# EasyEDA Pro project ROS_Car_F4VG_2024-01-24.eprj

# Schematic Schematic1
Create Date: 2024-01-24; Page Name: P1; Project Name: ROS_Car_F4VG_2024-01-24; Schematic Name: Schematic1; Update Date: 2024-03-10; Company: 嘉立创EDA; Page Size: A4; Version: V1.0
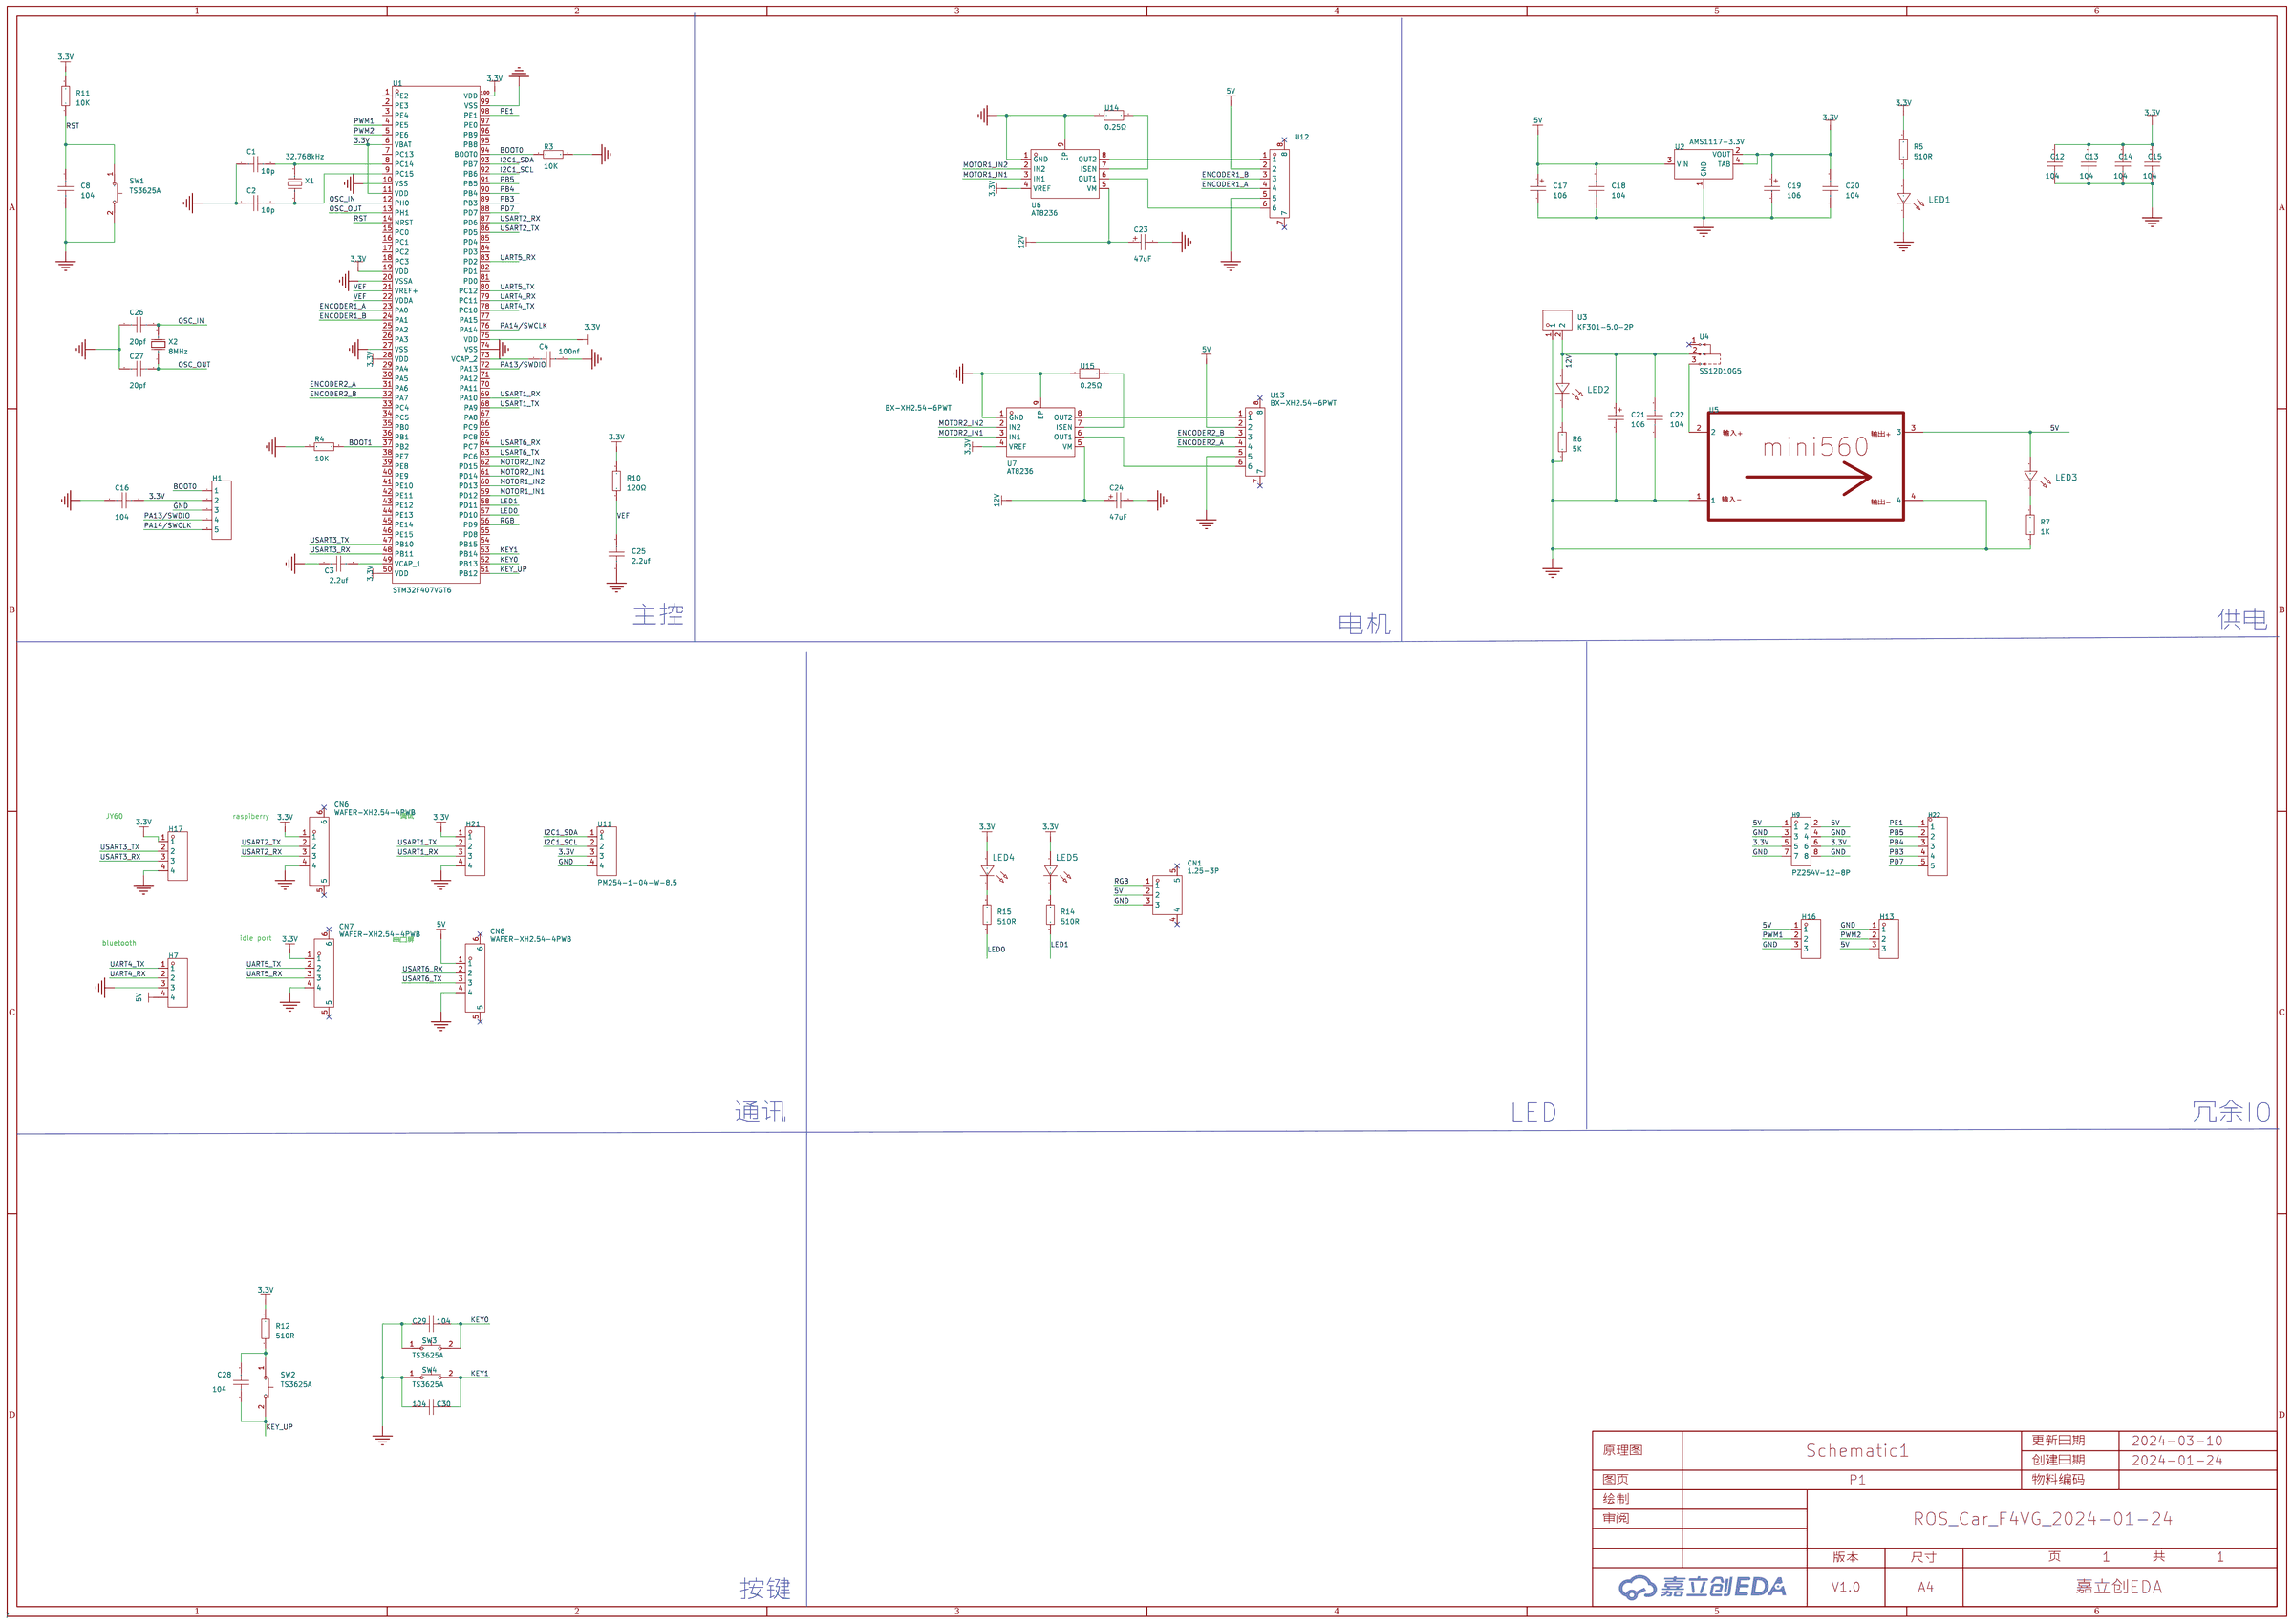
[diagram p0: schematic sheet]

## Parts
C1  10p  [C0603]
C2  10p  [C0603]
C3  2.2uf  [C0603]
C4  100nf  [C0603]
C8  104  [C0603]
C12  104  [C0603]
C13  104  [C0603]
C14  104  [C0603]
C15  104  [C0603]
C16  104  [C0603]
C17  106  [C_Ele_SMD_4x5.5mm]
C18  104  [C0603]
C19  106  [C_Ele_SMD_4x5.5mm]
C20  104  [C0603]
C21  106  [C_Ele_SMD_4x5.5mm]
C22  104  [C0603]
C23  47uF  [C_Ele_SMD_5x5.4mm]
C24  47uF  [C_Ele_SMD_5x5.4mm]
C25  2.2uf  [C0603]
C26  20pf  [C0603]
C27  20pf  [C0603]
C28  104  [C0603]
C29  104  [C0603]
C30  104  [C0603]
CN1  1.25-3P  [CONN-SMD_1.25-3P]
CN6  WAFER-XH2.54-4PWB  [CONN-TH_4P-P0.20_XUNPU_WAFER-XH2.54-4PWB]
CN7  WAFER-XH2.54-4PWB  [CONN-TH_4P-P0.20_XUNPU_WAFER-XH2.54-4PWB]
CN8  WAFER-XH2.54-4PWB  [CONN-TH_4P-P0.20_XUNPU_WAFER-XH2.54-4PWB]
H1  -  [HDR-TH_5P-P2.54-V-F]
H7  -  [HDR-TH_4P-P2.54-V-F]
H9  PZ254V-12-8P  [HDR-TH_8P-P2.54-V-M-R2-C4-S2.54]
H13  -  [HDR-TH_3P-P2.54-V-F]
H16  -  [HDR-TH_3P-P2.54-V-M]
H17  -  [HDR-TH_4P-P2.54-V-F]
H21  -  [HDR-TH_4P-P2.54-V-M]
H22  -  [HDR-TH_5P-P2.54-V-M]
LED1  -  [LED_0603]
LED2  -  [LED_0603]
LED3  -  [LED_0603]
LED4  -  [LED_0603]
LED5  -  [LED_0603]
R3  10K  [R0603]
R4  10K  [R0603]
R5  510R  [R0603]
R6  5K  [R0603]
R7  1K  [R0603]
R10  120Ω  [R0603]
R11  10K  [R0603]
R12  510R  [R0603]
R14  510R  [R0603]
R15  510R  [R0603]
SW1  TS3625A  [KEY-SMD_L6.0-W3.5-LS8.4]
SW2  TS3625A  [KEY-SMD_L6.0-W3.5-LS8.4]
SW3  TS3625A  [KEY-SMD_L6.0-W3.5-LS8.4]
SW4  TS3625A  [KEY-SMD_L6.0-W3.5-LS8.4]
U1  STM32F407VGT6  [LQFP-100_L14.0-W14.0-P0.50-LS16.0-BL]
U2  AMS1117-3.3V  [SOT_223]
U3  KF301-5.0-2P  [CONN-TH_P5.00_KF301-5.0-2P]
U4  SS12D10G5  [SW-TH_SHOU-HAN_SS12D10G4]
U5  -  [min560邮票孔]
U6  AT8236  [ESOP-8_L4.9-W3.9-P1.27-LS6.0-BL-EP]
U7  AT8236  [ESOP-8_L4.9-W3.9-P1.27-LS6.0-BL-EP]
U11  PM254-1-04-W-8.5  [HDR-TH_4P-P2.54-H-F-W10.0-N]
U12  BX-XH2.54-6PWT  [CONN-SMD_6P-P2.50_BX-XH2.54-6PWT]
U13  BX-XH2.54-6PWT  [CONN-SMD_6P-P2.50_BX-XH2.54-6PWT]
U14  0.25Ω  [R2512]
U15  0.25Ω  [R2512]
X1  32.768kHz  [OSC-SMD_L3.2-W1.5]
X2  8MHz  [CRYSTAL-SMD_L5.0-W3.2]

## Library data of the parts
C1-C4 C8 C12-C16 C18 C20 C22 C25-C30 = CAP_0603: Supplier Footprint: 0603
C17 C19 C21 = C_Ele_SMD_4x5.5mm: Supplier Footprint: SMD,4x5.5mm
C23 C24 = C_Ele_SMD_5x5.4mm: Supplier Footprint: SMD,5x5.4mm
CN1 = 1.25-3P: 插针结构:1x3P;间距:1.25mm;安装方式:-;行距:-;总PIN数:3P;排数:1;每排PIN数:3;参考系列:-;触头材质:-;; LCSC Part Name: 1x3P 间距:1.25mm 耐温; Supplier Part: C393944; Manufacturer: SHOU HAN(首韩); Supplier Footprint: SMD,P=1.25mm; JLCPCB Part Class: Extended Part; Datasheet: https://atta.szlcsc.com/upload/public/pdf/source/20190521/C393944_5848BB82F8C78E5E1FBACDDA5B503C47.pdf; Supplier: LCSC; Pins Structure: 1x3P; Pitch: 1.25mm; Number of Pins: 3P; Number of Rows: 1; Number of PINs Per Row: 3
CN6-CN8 = WAFER-XH2.54-4PWB: 插针结构:1x4P;间距:2.5mm;安装方式:卧贴;总PIN数:4P;排数:1;每排PIN数:4;额定电流:3A;工作温度范围:-25℃~+85℃;; LCSC Part Name: 1x4P 间距:2.5mm 卧贴; Supplier Part: C3029478; Manufacturer: XUNPU(讯普); Supplier Footprint: SMD,P=2.5mm; JLCPCB Part Class: 扩展库; Datasheet: https://atta.szlcsc.com/upload/public/pdf/source/20220527/7ACD2214A426F03D9ACD52F5A71E518C.pdf; Supplier: LCSC; Pins Structure: 1x4P; Pitch: 2.5mm; Mounting Style: 卧贴; Number of Pins: 4P; Number of Rows: 1; Number of PINs Per Row: 4; Current Rating (Max): 3A; Operating Temperature Range: -25℃~+85℃
H1 = HDR-F_2.54_1x5P: Supplier Part: C50950; Supplier Footprint: 插件
H7 H17 = HDR-F_2.54_1x4P: Supplier Part: C2718488; Supplier Footprint: 插件
H9 = PZ254V-12-8P: 排数:双排;总PIN位数:8P;间距:2.54mm;插针结构:2x4P;行距:2.54mm;安装类型:直插;圆针/方针:方针;额定电流:-;额定电压:-;配合针长度:6mm;塑高:2.5mm;端接针长度:3mm;触头材质:黄铜;触头镀层:-;工作温度范围:-40℃~+105℃;颜色:黑色;; LCSC Part Name: 2.54mm 2x4P 直插 方针; Supplier Part: C492421; Manufacturer: XFCN(兴飞); Supplier Footprint: 插件,P=2.54mm; JLCPCB Part Class: 扩展库; Datasheet: https://atta.szlcsc.com/upload/public/pdf/source/20200309/C492421_DC8A206AF99CD7755BD4A5B0BC48200B.pdf; Supplier: LCSC; Number of Rows: 双排; Number of Pins: 8P; Pitch: 2.54mm; Pin Structure: 2x4P; Row Spacing: 2.54mm; Mounting Type: 直插; Circluar Pins/Square Pins: 方针; Length of Mating Pin: 6mm; Insulation Height: 2.5mm; Length of End Connection Pin: 3mm; Contact Material: 黄铜; Operating Temperature Range: -40℃~+105℃; Color: 黑色
H13 = HDR-F_2.54_1x3P: Supplier Part: C541850; Supplier Footprint: 插件
H16 = HDR-M_2.54_1x3P: Supplier Part: C2937625; Supplier Footprint: 插件
H21 = HDR-M_2.54_1x4P: Supplier Part: C492403; Supplier Footprint: 插件
H22 = HDR-M_2.54_1x5P: Supplier Part: C358687; Supplier Footprint: 插件
LED1-LED5 = LED_0603-R: Supplier Footprint: 0603
R3-R7 R10-R12 R14 R15 = Res_0603: Supplier Footprint: 0603
SW1-SW4 = TS3625A: 电路结构:单刀单掷;按钮形状:矩形按钮;开关长度:6.1mm;开关宽度:3.65mm;开关高度:2.5mm;触点电流:50mA;额定电压(DC):12V;安装方式:立贴;带灯:-;作用力:250gf;机械寿命:-;; LCSC Part Name: 6.1*3.65*2.5mm 立贴 轻触开关; Supplier Part: C398053; Manufacturer: SHOU HAN(首韩); Supplier Footprint: SMD; JLCPCB Part Class: 扩展库; Datasheet: https://atta.szlcsc.com/upload/public/pdf/source/20190620/C398053_EFFFB524A3F966B1F45EE8333D1EDECC.pdf; Supplier: LCSC; Circuit: 单刀单掷; Actuator Style: 矩形按钮; Switch Length: 6.1mm; Switch Width: 3.65mm; Switch Height: 2.5mm; Contact Current: 50mA; Voltage Rating (DC): 12V; Mounting Style: 立贴; Operating Force: 250gf
U1 = STM32F407VGT6: CPU内核:ARM Cortex-M4;CPU最大主频:168MHz;工作电压范围:1.8V~3.6V;程序存储容量:1MB;程序存储器类型:FLASH;RAM总容量:192KB;GPIO端口数量:82;; Supplier Part: C12345; Manufacturer: ST(意法半导体); Supplier Footprint: LQFP-100(14x14); JLCPCB Part Class: 扩展库; Datasheet: https://atta.szlcsc.com/upload/public/pdf/source/20140801/1457707197138.pdf; Supplier: LCSC; CPU Core: ARM Cortex-M4; CPU Maximum Speed: 168MHz; Operating Voltage Range: 1.8V~3.6V; Program Storage Size: 1MB; Program Memory Type: FLASH; RAM Size: 192KB; GPIO Ports Number: 82; ADC (Bit): 12bit; DAC (Bit): 12bit; Universal Serial Bus: 有; Peripheral/Function: DMA；LCD/LED驱动; Watchdog: 有; Infrared Data Association: 有; Low-Voltage Detect: 有; LCD Module: 有; Direct Memory Access: 有; Internal Oscillator: 有; Operating Temperature Range: -40℃~+85℃
U2 = AMS1117
U3 = KF301-5.0-2P: 间距:5mm;结构:1x2P;排数:1;每排PIN数:2;安装方式:直插;额定电流:17A;额定电压:250V;线规 - AWG:14~22;线规 - mm2:1.5;工作温度范围:-30℃~+120℃;颜色:蓝色;; LCSC Part Name: 5mm 1x2P 排数:1 每排P数:2 直插 可拼接 铜 环保; Supplier Part: C474881; Manufacturer: KEFA(科发); Supplier Footprint: 插件,P=5mm; JLCPCB Part Class: 扩展库; Datasheet: https://atta.szlcsc.com/upload/public/pdf/source/20230317/03A5B5FC229D6F9225E8F51DA1A4E80A.pdf; Supplier: LCSC; Pitch: 5mm; Structure: 1x2P; Number of Rows: 1; Number of PINs Per Row: 2; Mounting Style: 直插; Current Rating (Max): 17A; Voltage Rating (Max): 250V; Wire Gauge - AWG: 14~22; Wire Gauge - mm2: 1.5; Operating Temperature Range: -30℃~+120℃; Color: 蓝色; Number of Pins: 2P
U4 = SS12D10G5: LCSC Part Name: 两档立式插件 3脚拨动开关 柄长5.0mm; Supplier Part: C7431054; Manufacturer: SHOU HAN(首韩); Supplier Footprint: 插件; JLCPCB Part Class: 扩展库; Datasheet: https://atta.szlcsc.com/upload/public/pdf/source/20231130/7A3DB6A149BF0A1DCFFE64FFC07FE434.pdf; Supplier: LCSC
U5 = mini560邮票孔
U6 U7 = AT8236: Supplier Part: C2827823; Manufacturer: 杭州中科微; Supplier Footprint: ESOP-8; JLCPCB Part Class: 扩展库; Datasheet: https://atta.szlcsc.com/upload/public/pdf/source/20210923/1552D95CBAF8BE780D06AE79E7783380.pdf; Supplier: LCSC
U11 = PM254-1-04-W-8.5: 插孔结构:1x4P;间距:2.54mm;行距:-;圆孔/方孔:方孔;安装类型:弯插;排数:单排;总孔位数:4P;额定电流:3A;额定电压:-;插孔方向:侧面;塑高:8.5mm;工作温度范围:-40℃~+105℃;; LCSC Part Name: 间距:2.54mm 1x4P 弯插; Supplier Part: C2897386; Manufacturer: HCTL(华灿天禄); Supplier Footprint: 弯插,P=2.54mm; JLCPCB Part Class: 扩展库; Datasheet: https://atta.szlcsc.com/upload/public/pdf/source/20230609/7BA40A3D721268A082DCDEAD4C99131B.pdf; Supplier: LCSC; Holes Structure: 1x4P; Pitch: 2.54mm; Circular Hole / Square Hole: 方孔; Mounting Type: 弯插; Number of Rows: 单排; Number of Holes: 4P; Current Rating (Max): 3A; Holes Direction: 侧面; Insulation Height: 8.5mm; Operating Temperature Range: -40℃~+105℃
U12 U13 = BX-XH2.54-6PWT: 插针结构:1x6P;间距:2.54mm;安装方式:卧贴;参考系列:XH;总PIN数:6P;排数:1;每排PIN数:6;行距:-;额定电流:3A;触头材质:黄铜;触头镀层:锡;工作温度范围:-25℃~+85℃;; Supplier Part: C18077876; Manufacturer: Bossie(博锡); Supplier Footprint: SMD,P=2.54mm,卧贴; Datasheet: https://atta.szlcsc.com/upload/public/pdf/source/20231017/64D9F5F4DF3195A55081C7A3CFAC85FD.pdf; Supplier: LCSC; Pins Structure: 1x6P; Pitch: 2.54mm; Mounting Style: 卧贴; Reference Series: XH; Number of Pins: 6P; Number of Rows: 1; Number of PINs Per Row: 6; Current Rating (Max): 3A; Contact Material: 黄铜; Contact Plating: 锡; Operating Temperature Range: -25℃~+85℃
U14 U15 = SCR2512F1R: 阻值:1Ω;精度:±1%;; LCSC Part Name: 1Ω ±1%; Supplier Part: C3017419; Manufacturer: VO(翔胜); Supplier Footprint: 2512; JLCPCB Part Class: Extended Part; Datasheet: https://atta.szlcsc.com/upload/public/pdf/source/20220513/247AF9639BA21CF93567DC289CCC6A22.pdf; Supplier: LCSC; Tolerance: ±1%
X1 = X321532768KGD2SI: 晶振类型:贴片晶振;频率:32.768kHz;常温频差:±20ppm;外接负载电容:12.5pF;; LCSC Part Name: 32.768kHz ±20ppm 12.5pF; Supplier Part: C620155; Manufacturer: YXC(扬兴晶振); Supplier Footprint: SMD3215-2P; JLCPCB Part Class: 扩展库; Datasheet: https://atta.szlcsc.com/upload/public/pdf/source/20210329/C620155_E5A74FC0D27C5E9015A8D75DE9484FEA.pdf; Supplier: LCSC; Crystal Type: 贴片晶振; Normal temperature Frequency Tolerance: ±20ppm; External load capacitor: 12.5pF; Operating Temperature: -40℃~+85℃
X2 = X50328MSB2GI: 晶振类型:贴片晶振;频率:8MHz;常温频差:±10ppm;外接负载电容:20pF;频率稳定度(全温):±50ppm;; LCSC Part Name: 8MHz ±10ppm 20pF YSX530GA; Supplier Part: C115962; Manufacturer: YXC(扬兴晶振); Supplier Footprint: SMD5032-2P; JLCPCB Part Class: 基础库; Datasheet: https://atta.szlcsc.com/upload/public/pdf/source/20230220/0EBFFB9D6D8CE6A211407822BBB6C516.pdf; Supplier: LCSC; Crystal Type: 贴片晶振; Normal temperature Frequency Tolerance: ±10ppm; External load capacitor: 20pF; Frequency Stability(Full temperature range): ±50ppm; Operating Temperature: -40℃~+85℃

## Nets
3.3V: C12.2 C13.2 C14.2 C15.2 C16.2 C19.1 C20.2 CN6.1 CN7.1 H1.2 H9.5 H9.6 H17.1 H21.1 LED4.2(A) LED5.2(A) R5.2 R10.2 R11.2 R12.1 U1.6(VBAT) U1.11(VDD) U1.19(VDD) U1.28(VDD) U1.50(VDD) U1.75(VDD) U1.100(VDD) U2.2(VOUT) U2.4(TAB) U6.4(VREF) U7.4(VREF) U11.3
5V: C17.1 C18.2 CN1.2 CN8.1 H7.4 H9.1 H9.2 H13.3 H16.1 LED3.2(A) U2.3(VIN) U5.3 U12.2 U13.2
12V: C21.1 C22.2 C23.1 C24.1 LED2.2(A) U3.2 U4.2 U6.5(VM) U7.5(VM)
GND: C1.1 C2.1 C3.1 C4.2 C8.2 C12.1 C13.1 C14.1 C15.1 C16.1 C17.2 C18.1 C19.2 C20.1 C21.2 C22.1 C23.2 C24.2 C25.1 C26.1 C27.1 C29.2 C30.2 CN1.3 CN6.4 CN7.4 CN8.4 H1.3 H7.3 H9.3 H9.4 H9.7 H9.8 H13.1 H16.3 H17.4 H21.4 LED1.1(C) R3.2 R4.1 R6.1 R7.1 SW1.2 SW3.1 SW4.1 U1.10(VSS) U1.20(VSSA) U1.27(VSS) U1.74(VSS) U1.99(VSS) U2.1(GND) U3.1 U5.1 U5.4 U6.1(GND) U6.9(EP) U7.1(GND) U7.9(EP) U11.4 U12.5 U13.5 U14.1 U15.1
BOOT0: H1.1 R3.1 U1.94(BOOT0)
BOOT1: R4.2 U1.37(PB2)
ENCODER1_A: U1.23(PA0) U12.4
ENCODER1_B: U1.24(PA1) U12.3
ENCODER2_A: U1.31(PA6) U13.4
ENCODER2_B: U1.32(PA7) U13.3
I2C1_SCL: U1.92(PB6) U11.2
I2C1_SDA: U1.93(PB7) U11.1
KEY0: C29.1 SW3.2 U1.52(PB13)
KEY1: C30.1 SW4.2 U1.53(PB14)
KEY_UP: C28.1 SW2.2 U1.51(PB12)
LED0: R15.1 U1.57(PD10)
LED1: R14.1 U1.58(PD11)
MOTOR1_IN1: U1.59(PD12) U6.3(IN1)
MOTOR1_IN2: U1.60(PD13) U6.2(IN2)
MOTOR2_IN1: U1.61(PD14) U7.3(IN1)
MOTOR2_IN2: U1.62(PD15) U7.2(IN2)
OSC_IN: C26.2 U1.12(PH0) X2.2(OSC2)
OSC_OUT: C27.2 U1.13(PH1) X2.1(OSC1)
PA13/SWDIO: H1.4 U1.72(PA13)
PA14/SWCLK: H1.5 U1.76(PA14)
PB3: H22.4 U1.89(PB3)
PB4: H22.3 U1.90(PB4)
PB5: H22.2 U1.91(PB5)
PD7: H22.5 U1.88(PD7)
PE1: H22.1 U1.98(PE1)
PWM1: H16.2 U1.4(PE5)
PWM2: H13.2 U1.5(PE6)
RGB: CN1.1 U1.56(PD9)
RST: C8.1 R11.1 SW1.1 U1.14(NRST)
UART4_RX: H7.2 U1.79(PC11)
UART4_TX: H7.1 U1.78(PC10)
UART5_RX: CN7.3 U1.83(PD2)
UART5_TX: CN7.2 U1.80(PC12)
USART1_RX: H21.3 U1.69(PA10)
USART1_TX: H21.2 U1.68(PA9)
USART2_RX: CN6.3 U1.87(PD6)
USART2_TX: CN6.2 U1.86(PD5)
USART3_RX: H17.3 U1.48(PB11)
USART3_TX: H17.2 U1.47(PB10)
USART6_RX: CN8.2 U1.64(PC7)
USART6_TX: CN8.3 U1.63(PC6)
VEF: C25.2 R10.1 U1.21(VREF+) U1.22(VDDA)
$1N1495: C2.2 U1.9(PC15) X1.1
$1N1501: C1.2 U1.8(PC14) X1.2
$1N1585: C3.2 U1.49(VCAP_1)
$1N1640: C4.1 U1.73(VCAP_2)
$1N4014: LED1.2(A) R5.1
$1N6637: LED2.1(C) R6.2
$1N7193: LED3.1(C) R7.2
$1N8589: U6.7(ISEN) U14.2
$1N8599: U6.8(OUT2) U12.1
$1N8605: U6.6(OUT1) U12.6
$1N8980: U7.7(ISEN) U15.2
$1N8984: U7.8(OUT2) U13.1
$1N8986: U7.6(OUT1) U13.6
$1N14600: C28.2 R12.2 SW2.1
$1N15937: LED4.1(C) R15.2
$1N16000: LED5.1(C) R14.2
$1N24251: U4.3 U5.2

Not connected (* = marked no-connect by the designer): CN1 4* 5*; CN6 5* 6*; CN7 5* 6*; CN8 5* 6*; U1 1(PE2) 2(PE3) 3(PE4) 7(PC13) 15(PC0) 16(PC1) 17(PC2) 18(PC3) 25(PA2) 26(PA3) 29(PA4) 30(PA5) 33(PC4) 34(PC5) 35(PB0) 36(PB1) 38(PE7) 39(PE8) 40(PE9) 41(PE10) 42(PE11) 43(PE12) 44(PE13) 45(PE14) 46(PE15) 54(PB15) 55(PD8) 65(PC8) 66(PC9) 67(PA8) 70(PA11) 71(PA12) 77(PA15) 81(PD0) 82(PD1) 84(PD3) 85(PD4) 95(PB8) 96(PB9) 97(PE0); U4 1*; U12 7* 8*; U13 7* 8*

## Notes on the sheet
- 主控
- 电机
- 供电
- JY60
- raspiberry
- 调试
- idle port
- bluetooth
- 串口屏
- 通讯
- LED
- 冗余IO
- 按键

# Board PCB1
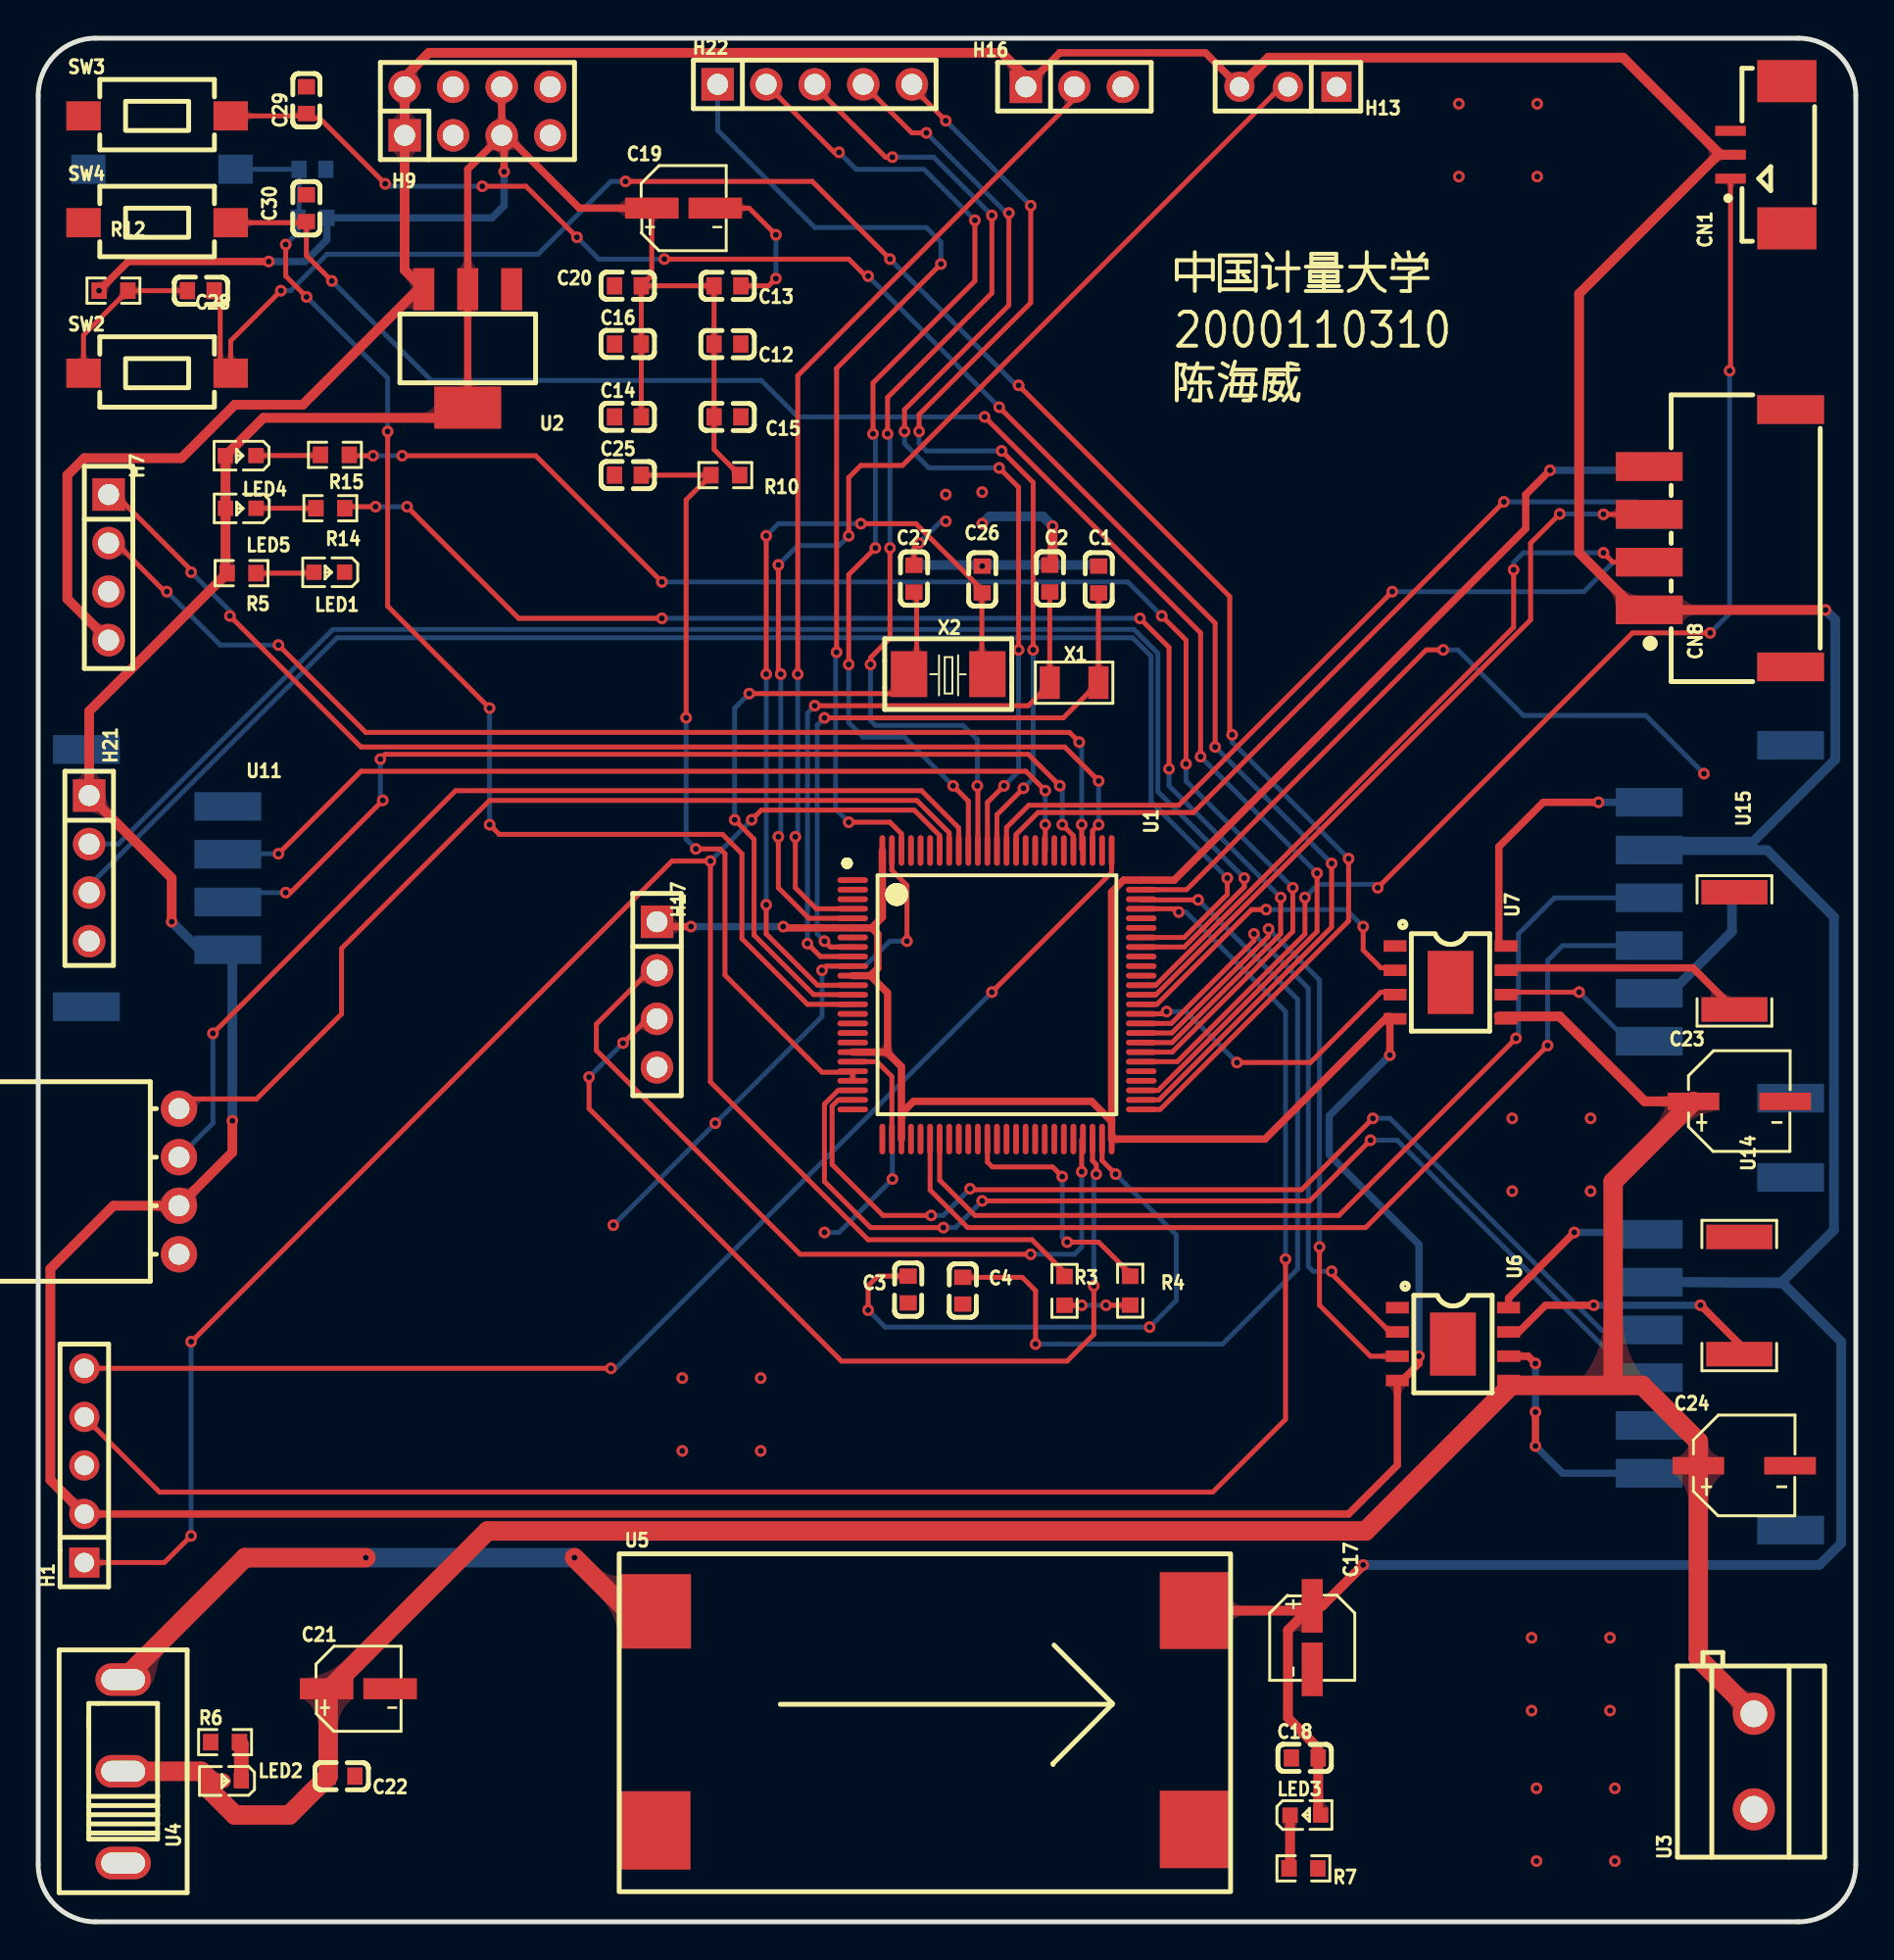
[diagram p1: board, top side]
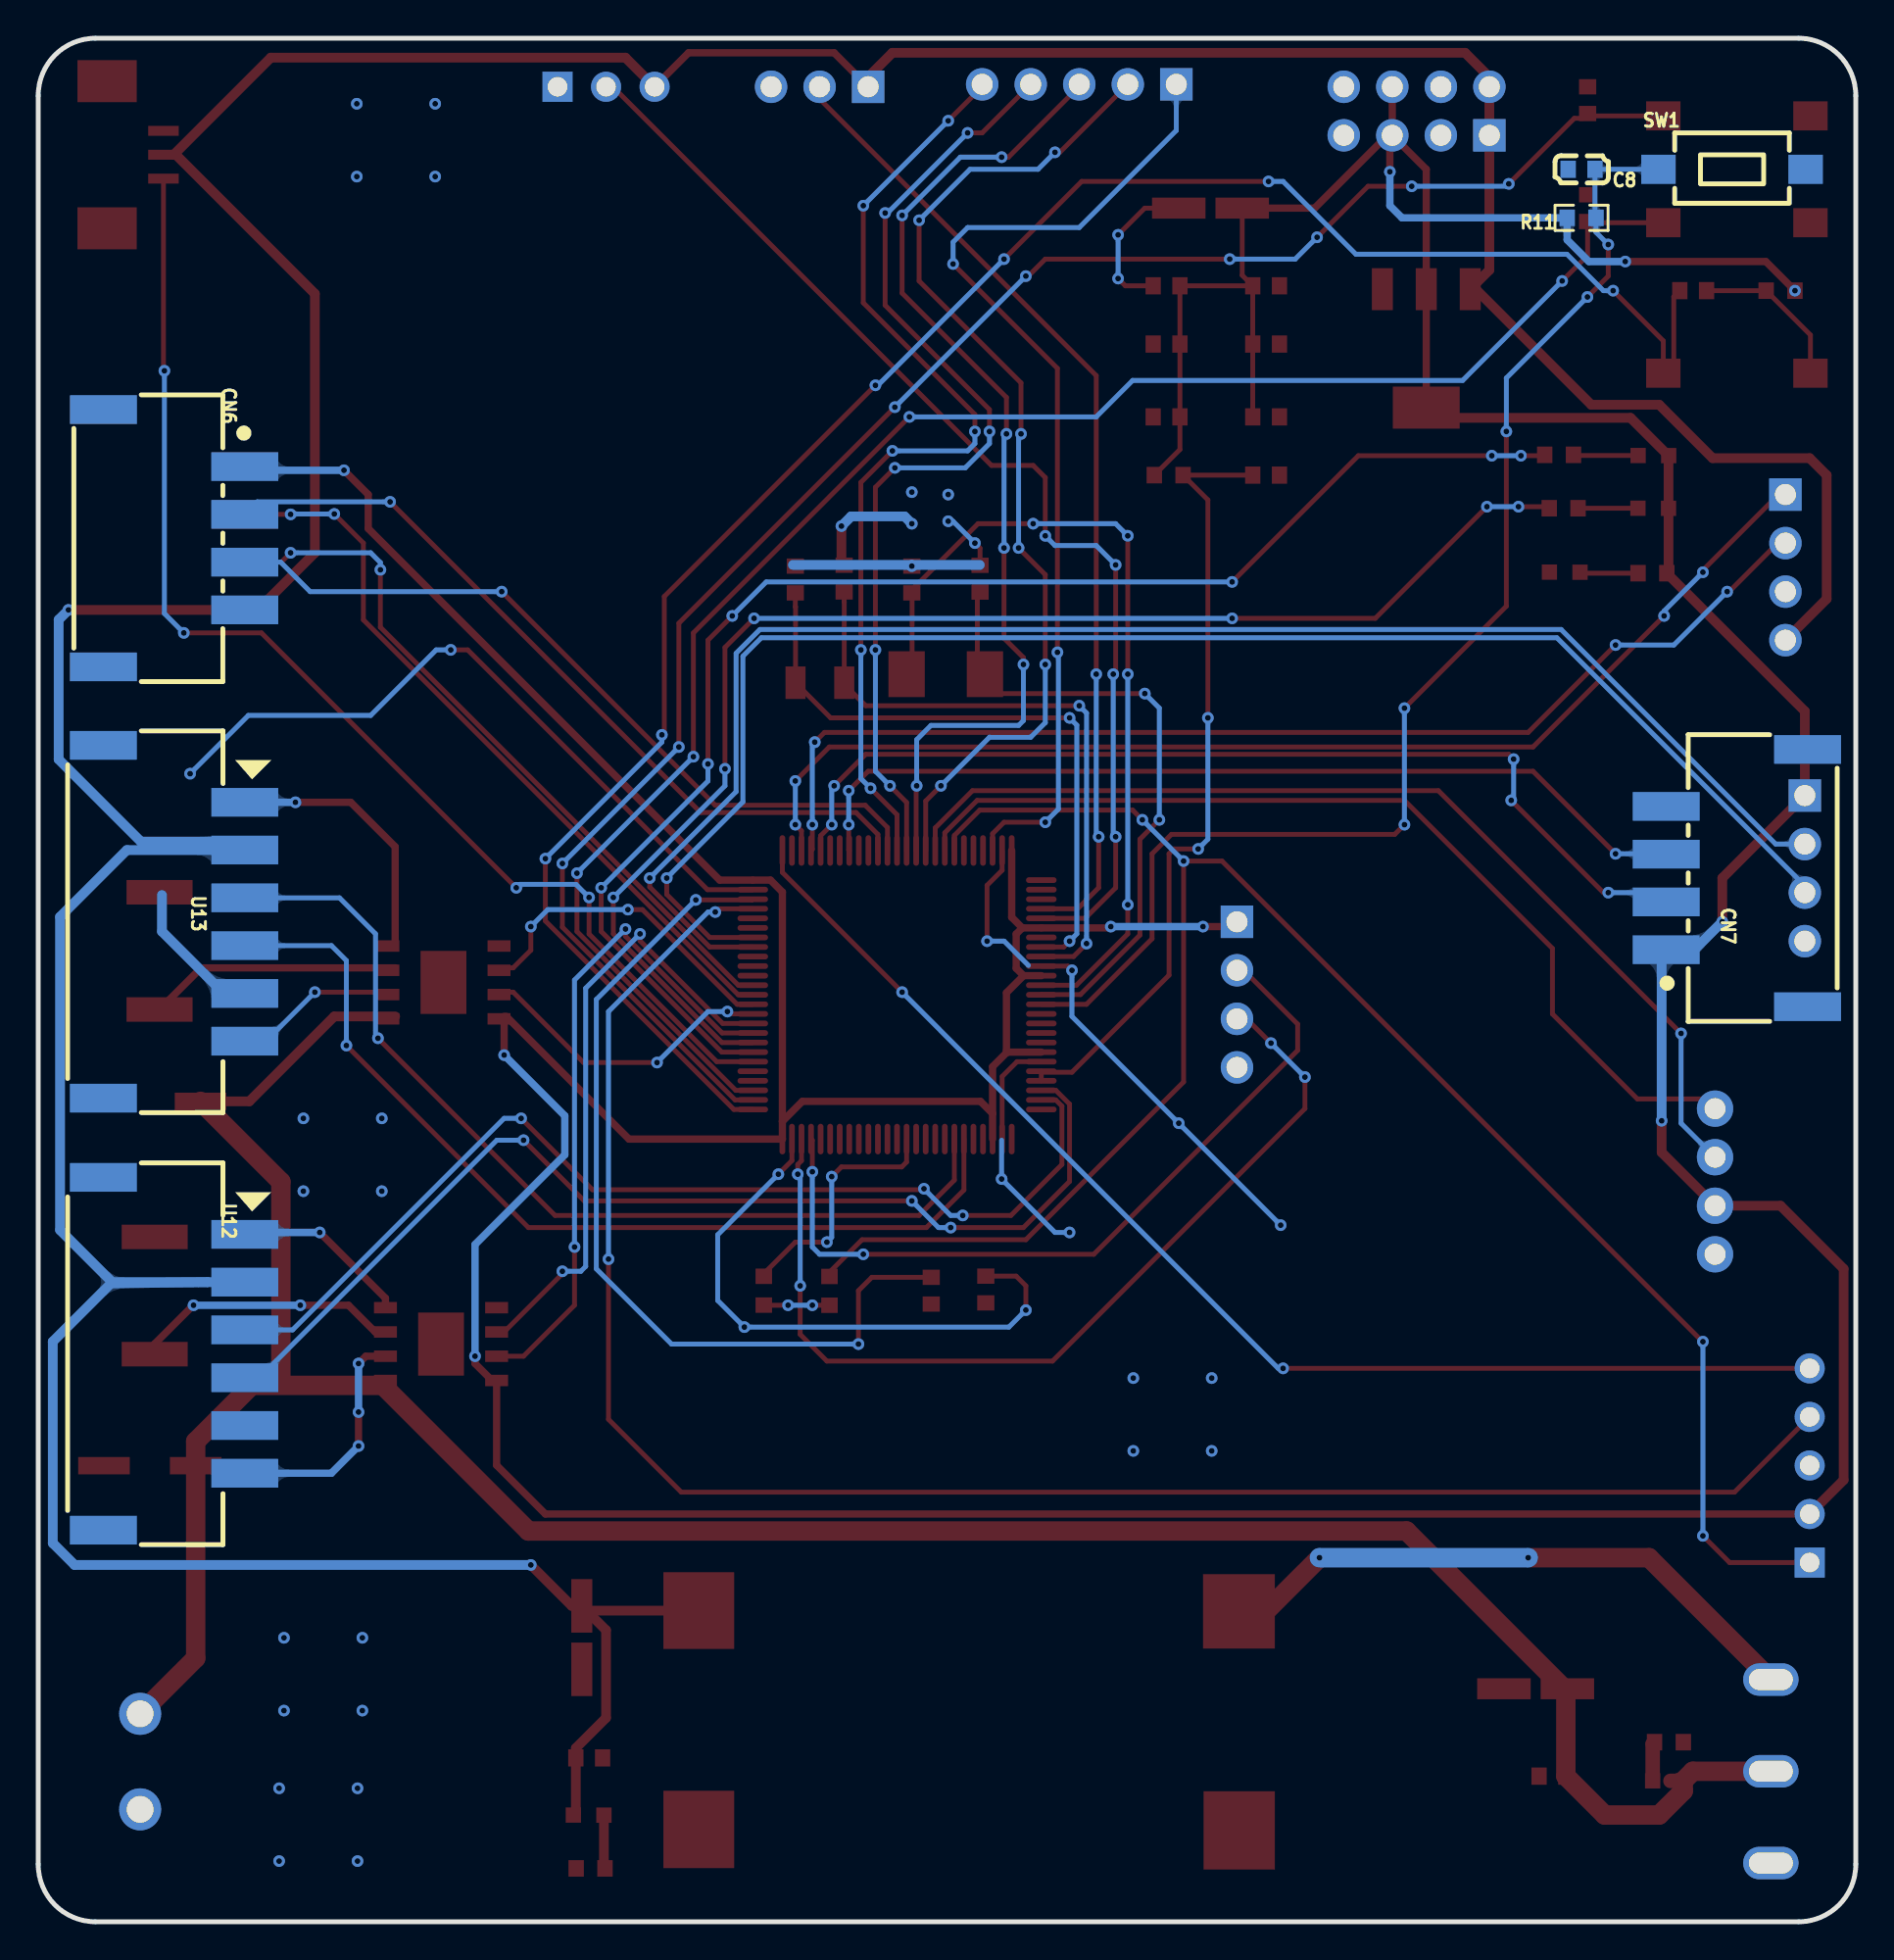
[diagram p2: board, bottom side, seen from below]

Outline 95.12 x 98.55 mm; copper layers: Top Layer, Bottom Layer. Coordinates in mm from the lower left corner of the outline.
Outline path: 0,95.55 0,3 arc(0.88,0.88) 3,0 92.12,0 arc(94.24,0.88) 95.12,3 95.12,95.55 arc(94.24,97.67) 92.12,98.55 3,98.55 arc(0.88,97.67) 0,95.55
Stack: Top Layer 0.035mm / Dielectric1 1.51mm FR4 er 4.5 / Bottom Layer 0.035mm

## Design rules (mm)
template: JLCPCB Capability(Two Layers Board)
spacing copperThickness1oz (default): track to track 0.102, other pairs 0.152 to 0.3
spacing copperThickness2oz: track to track 0.203, other pairs 0.152 to 0.3
track width copperThickness1oz (default): min 0.127, default 0.254, max 2.54
track width copperThickness2oz: min 0.203, default 0.254, max 2.54
differential pair differentialPair (default): width min 0.127, default 0.254, max 2.54; gap min 0.152, default 0.152
via viaSize (default): diameter min 0.5, default 0.61, max 10; hole min 0.3, default 0.305, max 6.3

## Placement (name value [footprint] x y rotation side)
C1  10p  [C0603]  55.5 70.23 270 top
C2  10p  [C0603]  52.94 70.28 270 top
C3  2.2uf  [C0603]  45.53 33.08 90 top
C4  100nf  [C0603]  48.39 33.02 270 top
C8  104  [C0603]  14.35 91.69 0 bottom
C12  104  [C0603]  36.07 82.55 180 top
C13  104  [C0603]  36.07 85.6 180 top
C14  104  [C0603]  30.86 78.74 0 top
C15  104  [C0603]  36.07 78.74 180 top
C16  104  [C0603]  30.86 82.55 0 top
C17  106  [C_Ele_SMD_4x5.5mm]  66.67 14.99 270 top
C18  104  [C0603]  66.29 8.57 0 top
C19  106  [C_Ele_SMD_4x5.5mm]  33.66 89.66 0 top
C20  104  [C0603]  30.86 85.6 0 top
C21  106  [C_Ele_SMD_4x5.5mm]  16.64 12.19 0 top
C22  104  [C0603]  15.88 7.62 180 top
C23  47uF  [C_Ele_SMD_5x5.4mm]  89.03 42.93 0 top
C24  47uF  [C_Ele_SMD_5x5.4mm]  89.28 23.86 0 top
C25  2.2uf  [C0603]  30.86 75.69 0 top
C26  20pf  [C0603]  49.4 70.23 270 top
C27  20pf  [C0603]  45.83 70.27 270 top
C28  104  [C0603]  8.51 85.34 180 top
C29  104  [C0603]  14.03 95.31 90 top
C30  104  [C0603]  14.03 89.66 90 top
CN1  1.25-3P  [CONN-SMD_1.25-3P]  90.04 92.46 90 top
CN6  WAFER-XH2.54-4PWB  [CONN-TH_4P-P0.20_XUNPU_WAFER-XH2.54-4PWB]  88.01 72.39 270 bottom
CN7  WAFER-XH2.54-4PWB  [CONN-TH_4P-P0.20_XUNPU_WAFER-XH2.54-4PWB]  6.22 54.61 90 bottom
CN8  WAFER-XH2.54-4PWB  [CONN-TH_4P-P0.20_XUNPU_WAFER-XH2.54-4PWB]  88.01 72.39 90 top
H1  -  [HDR-TH_5P-P2.54-V-F]  2.41 23.88 90 top
H7  -  [HDR-TH_4P-P2.54-V-F]  3.68 70.87 270 top
H9  PZ254V-12-8P  [HDR-TH_8P-P2.54-V-M-R2-C4-S2.54]  22.99 94.74 0 top
H13  -  [HDR-TH_3P-P2.54-V-F]  65.41 96.01 180 top
H16  -  [HDR-TH_3P-P2.54-V-M]  54.23 96.01 0 top
H17  -  [HDR-TH_4P-P2.54-V-F]  32.39 48.51 270 top
H21  -  [HDR-TH_4P-P2.54-V-M]  2.67 55.12 270 top
H22  -  [HDR-TH_5P-P2.54-V-M]  40.64 96.14 0 top
LED1  -  [LED_0603]  15.18 70.61 180 top
LED2  -  [LED_0603]  9.78 7.37 180 top
LED3  -  [LED_0603]  66.37 5.59 0 top
LED4  -  [LED_0603]  10.54 76.71 180 top
LED5  -  [LED_0603]  10.55 73.95 180 top
R3  10K  [R0603]  53.71 33.01 270 top
R4  10K  [R0603]  57.15 33.02 90 top
R5  510R  [R0603]  10.64 70.56 180 top
R6  5K  [R0603]  9.78 9.4 0 top
R7  1K  [R0603]  66.21 2.79 180 top
R10  120Ω  [R0603]  35.96 75.69 0 top
R11  10K  [R0603]  14.35 89.15 0 bottom
R12  510R  [R0603]  3.94 85.34 0 top
R14  510R  [R0603]  15.29 73.96 180 top
R15  510R  [R0603]  15.53 76.75 180 top
SW1  TS3625A  [KEY-SMD_L6.0-W3.5-LS8.4]  6.48 91.69 180 bottom
SW2  TS3625A  [KEY-SMD_L6.0-W3.5-LS8.4]  6.22 81.03 0 top
SW3  TS3625A  [KEY-SMD_L6.0-W3.5-LS8.4]  6.22 94.49 0 top
SW4  TS3625A  [KEY-SMD_L6.0-W3.5-LS8.4]  6.22 88.9 0 top
U1  STM32F407VGT6  [LQFP-100_L14.0-W14.0-P0.50-LS16.0-BL]  50.18 48.5 270 top
U2  AMS1117-3.3V  [SOT_223]  22.48 82.3 180 top
U3  KF301-5.0-2P  [CONN-TH_P5.00_KF301-5.0-2P]  89.79 8.38 90 top
U4  SS12D10G5  [SW-TH_SHOU-HAN_SS12D10G4]  4.45 7.87 90 top
U5  -  [min560邮票孔]  33.4 3.56 0 top
U6  AT8236  [ESOP-8_L4.9-W3.9-P1.27-LS6.0-BL-EP]  74.04 30.23 270 top
U7  AT8236  [ESOP-8_L4.9-W3.9-P1.27-LS6.0-BL-EP]  73.91 49.15 270 top
U11  PM254-1-04-W-8.5  [HDR-TH_4P-P2.54-H-F-W10.0-N]  7.37 38.73 270 top
U12  BX-XH2.54-6PWT  [CONN-SMD_6P-P2.50_BX-XH2.54-6PWT]  88.01 29.72 270 bottom
U13  BX-XH2.54-6PWT  [CONN-SMD_6P-P2.50_BX-XH2.54-6PWT]  88.01 52.32 270 bottom
U14  0.25Ω  [R2512]  89.03 32.77 270 top
U15  0.25Ω  [R2512]  88.77 50.8 270 top
X1  32.768kHz  [OSC-SMD_L3.2-W1.5]  54.21 64.83 0 top
X2  8MHz  [CRYSTAL-SMD_L5.0-W3.2]  47.63 65.28 0 top

## Footprints (pads in the part's own frame, mm; a bottom-side part is the same pattern mirrored in y, then rotated)
C0603
  rect 0.8x0.9 smd: 1(-0.7,0) 2(0.7,0)
C_Ele_SMD_4x5.5mm
  rect 2.8x1.1 smd: 1(-1.543,0) 2(1.778,0)
C_Ele_SMD_5x5.4mm
  rect 2.7x0.91 smd: 1(-2.4,0) 2(2.4,0)
CONN-SMD_1.25-3P
  rect 0.52x1.6 smd: 1(-1.25,1.475) 2(0,1.475) 3(1.25,1.475)
  rect 2.2x3.1 smd: 4(3.85,-1.475) 5(-3.85,-1.475)
CONN-SMD_6P-P2.50_BX-XH2.54-6PWT
  rect 1.5x3.5 smd: 1(-6.25,3.7) 2(-3.75,3.7) 3(-1.25,3.7) 4(1.25,3.7) 5(3.75,3.7) 6(6.25,3.7) 7(9.23,-3.7) 8(-9.23,-3.7)
CONN-TH_4P-P0.20_XUNPU_WAFER-XH2.54-4PWB
  rect 1.5x3.5 smd: 1(-3.75,3.7) 2(-1.25,3.7) 3(1.25,3.7) 4(3.75,3.7) 5(-6.73,-3.7) 6(6.73,-3.7)
CONN-TH_P5.00_KF301-5.0-2P
  round 2.2 hole 1.4: 1(-2.5,0) 2(2.5,0)
CRYSTAL-SMD_L5.0-W3.2
  rect 1.9x2.4 smd: 1(-2.05,0) 2(2.05,0)
ESOP-8_L4.9-W3.9-P1.27-LS6.0-BL-EP
  rect 0.6x1.2 smd: 1(-1.905,-2.909) 2(-0.635,-2.909) 3(0.635,-2.909) 4(1.905,-2.909) 5(1.905,2.909) 6(0.635,2.909) 7(-0.635,2.909) 8(-1.905,2.909)
  rect 3.3x2.4 smd: 9(0,0)
HDR-TH_3P-P2.54-V-F
  rect 1.575x1.575 hole 1.02: 1(-2.54,0)
  round 1.575 hole 1.02: 2(0,0) 3(2.54,0)
HDR-TH_3P-P2.54-V-M
  rect 1.7x1.7 hole 1.1: 1(-2.54,0)
  round 1.7 hole 1.1: 2(0,0) 3(2.54,0)
HDR-TH_4P-P2.54-H-F-W10.0-N
  round 1.9 hole 1.1: 1(-3.81,0) 2(-1.27,0) 3(1.27,0) 4(3.81,0)
HDR-TH_4P-P2.54-V-F
  rect 1.7x1.7 hole 1.1: 1(-3.81,0)
  round 1.7 hole 1.1: 2(-1.27,0) 3(1.27,0) 4(3.81,0)
HDR-TH_4P-P2.54-V-M
  rect 1.7x1.7 hole 1.1: 1(-3.81,0)
  round 1.7 hole 1.1: 2(-1.27,0) 3(1.27,0) 4(3.81,0)
HDR-TH_5P-P2.54-V-F
  rect 1.575x1.575 hole 1.02: 1(-5.08,0)
  round 1.575 hole 1.02: 2(-2.54,0) 3(0,0) 4(2.54,0) 5(5.08,0)
HDR-TH_5P-P2.54-V-M
  rect 1.7x1.7 hole 1.1: 1(-5.08,0)
  round 1.7 hole 1.1: 2(-2.54,0) 3(0,0) 4(2.54,0) 5(5.08,0)
HDR-TH_8P-P2.54-V-M-R2-C4-S2.54
  rect 1.7x1.7 hole 1.1: 1(-3.81,-1.27)
  round 1.7 hole 1.1: 2(-3.81,1.27) 3(-1.27,-1.27) 4(-1.27,1.27) 5(1.27,-1.27) 6(1.27,1.27) 7(3.81,-1.27) 8(3.81,1.27)
KEY-SMD_L6.0-W3.5-LS8.4
  rect 1.8x1.524 smd: 1(-3.85,0) 2(3.85,0)
LED_0603
  rect 0.8x0.8 smd: 1(-0.851,-0.01) 2(0.75,-0.005)
LQFP-100_L14.0-W14.0-P0.50-LS16.0-BL
  oval 0.3x1.6 smd: 1(-6,-7.55) 2(-5.5,-7.55) 3(-5,-7.55) 4(-4.5,-7.55) 5(-4,-7.55) 6(-3.5,-7.55) 7(-3,-7.55) 8(-2.5,-7.55) 9(-2,-7.55) 10(-1.5,-7.55) 11(-1,-7.55) 12(-0.5,-7.55) 13(0,-7.55) 14(0.5,-7.55) 15(1,-7.55) 16(1.5,-7.55) 17(2,-7.55) 18(2.5,-7.55) 19(3,-7.55) 20(3.5,-7.55) 21(4,-7.55) 22(4.5,-7.55) 23(5,-7.55) 24(5.5,-7.55) 25(6,-7.55) 51(6,7.55) 52(5.5,7.55) 53(5,7.55) 54(4.5,7.55) 55(4,7.55) 56(3.5,7.55) 57(3,7.55) 58(2.5,7.55) 59(2,7.55) 60(1.5,7.55) 61(1,7.55) 62(0.5,7.55) 63(0,7.55) 64(-0.5,7.55) 65(-1,7.55) 66(-1.5,7.55) 67(-2,7.55) 68(-2.5,7.55) 69(-3,7.55) 70(-3.5,7.55) 71(-4,7.55) 72(-4.5,7.55) 73(-5,7.55) 74(-5.5,7.55) 75(-6,7.55)
  oval 1.6x0.3 smd: 26(7.55,-6) 27(7.55,-5.5) 28(7.55,-5) 29(7.55,-4.5) 30(7.55,-4) 31(7.55,-3.5) 32(7.55,-3) 33(7.55,-2.5) 34(7.55,-2) 35(7.55,-1.5) 36(7.55,-1) 37(7.55,-0.5) 38(7.55,0) 39(7.55,0.5) 40(7.55,1) 41(7.55,1.5) 42(7.55,2) 43(7.55,2.5) 44(7.55,3) 45(7.55,3.5) 46(7.55,4) 47(7.55,4.5) 48(7.55,5) 49(7.55,5.5) 50(7.55,6) 76(-7.55,6) 77(-7.55,5.5) 78(-7.55,5) 79(-7.55,4.5) 80(-7.55,4) 81(-7.55,3.5) 82(-7.55,3) 83(-7.55,2.5) 84(-7.55,2) 85(-7.55,1.5) 86(-7.55,1) 87(-7.55,0.5) 88(-7.55,0) 89(-7.55,-0.5) 90(-7.55,-1) 91(-7.55,-1.5) 92(-7.55,-2) 93(-7.55,-2.5) 94(-7.55,-3) 95(-7.55,-3.5) 96(-7.55,-4) 97(-7.55,-4.5) 98(-7.55,-5) 99(-7.55,-5.5) 100(-7.55,-6)
min560邮票孔
  custom 3.732x4.13 smd: 1(-1.131,1.21)
  custom 3.759x3.894 smd: 2(-1.117,12.685)
  custom 3.705x4.027 smd: 3(27.151,12.723)
  custom 3.705x4.05 smd: 4(27.151,1.277)
OSC-SMD_L3.2-W1.5
  rect 1.05x1.7 smd: 1(-1.275,0) 2(1.275,0)
R0603
  rect 0.806x0.864 smd: 1(-0.753,0) 2(0.753,0)
R2512
  rect 1.282x3.456 smd: 1(-3.067,0) 2(3.067,0)
SOT_223
  rect 1.1x2.2 smd: 1(-2.299,-3.126) 2(0,-3.126) 3(2.301,-3.126)
  rect 3.5x2.2 smd: 4(0,3.072)
SW-TH_SHOU-HAN_SS12D10G4
  oval 1.7x2.9 hole 1.1x2.3: 1(-4.8,0) 2(0,0) 3(4.8,0)

## Nets
As in the schematic.

Pads without a net: CN1 4 5; CN6 5 6; CN7 5 6; CN8 5 6; U1 1 2 3 7 15 16 17 18 25 26 29 30 33 34 35 36 38 39 40 41 42 43 44 45 46 54 55 65 66 67 70 71 77 81 82 84 85 95 96 97; U4 1; U12 7 8; U13 7 8

## Via types
v1: diameter 0.61, hole 0.305, Top Layer to Bottom Layer, 207 vias

## Routing (per net, layer and track width the routed paths; a pad name or vN(x,y) marks a point on that pad's centre or on a via; arc(x,y) is an arc through that point)
3.3V: length 370.8
  Top Layer w0.254: R10.2 35.37,77.03 C15.2 C12.2 C13.2 C20.2 ; C20.2 32.11,86.15 C19.1 ; C20.2 C16.2 C14.2 ; 9.8,76.7 LED4.2
  Top Layer w0.381: 45.18,42.29 45.81,42.93 55.13,42.93 56.18,41.88 ; 45.18,42.29 U1.28 ; 45.18,42.29 45.18,44.74 44.41,45.5 44.36,45.5 ; v1(70.74,45.35) 70.74,47.37 ; v1(24.38,91.57) 24.38,93.34 H9.5 22.48,91.69 U2.2 U2.4 ; v1(79.12,75.95) 77.85,74.68 77.85,72.9 59.46,54.5 U1.75 56.8,54.5 56.18,53.88 56.18,41.88 ; H17.1 32.64,52.07 v1(34.16,52.07) ; 44.36,45.5 U1.19 ; 44.36,45.5 44.45,45.59 44.45,48.61 43.55,49.5 ; 56.18,41.88 U1.50 64.21,40.95 70.62,47.37 ; v1(38.99,52.07) 39.06,52 U1.6 43.62,52 ; U1.11 43.55,49.5 ; 43.55,49.5 43.94,49.89 43.94,51.68 43.62,52 ; U1.100 44.18,52.56 43.62,52 ; v1(3.18,85.34) 4.71,86.87 v1(12.06,86.87) ; v1(72.26,29.59) 72.26,29.21 71.37,28.32 U6.4 71.13,23.89 68.58,21.34 H1.2 ; 24.26,96.52 24.26,93.73 28.32,89.66 C19.1
  Top Layer w0.508: U2.4 21.94,78.69 11.79,78.69 9.8,76.7 9.8,70.65 R5.2 2.67,63.34 H21.1 6.98,54.61 v1(6.98,52.32) ; v1(10.16,41.91) 10.16,40.26 U11.3 3.94,37.47 0.64,34.16 0.64,23.11 H1.2
  Bottom Layer w0.254: 24.38,93.34 H9.5
  Bottom Layer w0.381: CN6.1 84.12,75.95 v1(79.12,75.95) ; v1(12.06,86.87) 13.97,86.87 15.1,88 R11.2 23.75,89.15 24.38,89.79 v1(24.38,91.57) ; v1(72.26,29.59) 72.26,35.43 67.56,40.13 67.56,42.17 v1(70.74,45.35) ; v1(34.16,52.07) v1(38.99,52.07)
  Bottom Layer w0.508: v1(6.98,52.32) 8.45,50.86 CN7.1 10.16,50.62 v1(10.16,41.91)
5V: length 281.5
  Top Layer w0.381: 66.42,16.28 66.67,16.53 ; H13.3 61.09,97.79 53.47,97.79 H16.1 ; CN1.2 88.03,92.46
  Top Layer w0.508: H7.4 1.52,69.22 1.52,75.69 2.41,76.58 7.49,76.58 10.29,79.38 13.84,79.38 19.89,85.42 U2.3 19.18,86.42 H9.1 19.18,96.52 20.45,97.79 50.42,97.79 51.69,96.52 ; LED3.2 66.99,5.71 66.99,9.09 65.41,10.67 65.41,15.26 66.42,16.28 U5.3 ; v1(69.34,18.67) 67.2,16.53 66.67,16.53 ; H13.3 64.39,97.54 82.95,97.54 88.03,92.46 87.92,92.46 80.64,85.18 80.64,71.63 83.63,68.64 CN8.1 v1(93.54,68.64)
  Bottom Layer w0.508: v1(69.34,18.67) 93.22,18.67 94.36,19.81 94.36,30.35 91.31,33.4 86.26,33.47 ; 86.26,33.47 91.25,33.47 93.98,36.2 93.98,52.58 90.48,56.07 U13.2 84.75,56.52 89.75,56.52 94.05,60.82 94.05,68.13 v1(93.54,68.64) ; 86.26,33.47 U12.2
12V: length 141.1
  Top Layer w0.508: 15.17,12.11 C21.1 ; C23.1 84.07,42.93 79.63,47.37 76.44,47.37
  Top Layer w0.762: LED2.2 9.7,7.37
  Top Layer w1.016: U3.2 86.88,13.79 C24.1 86.88,25.13 83.95,28.07 77.2,28.07 ; C23.1 82.42,38.72 82.42,28.32 ; 76.95,27.93 69.47,20.45 23.51,20.45 15.17,12.11 C22.2 13.14,5.59 10.29,5.59 9.03,6.85 LED2.2 8.53,7.87 U4.2
GND: length 115.2
  Top Layer w0.254: v1(41.02,49.78) 41.24,50 U1.10 ; v1(73.53,66.55) 72.64,66.55 60.1,54 U1.74 ; v1(46.1,72.14) 45.83,71.87 45.83,70.97 ; U1.27 44.68,44.22 43.9,45 U1.20 ; C13.1 38.23,85.6 v1(38.61,85.98) ; v1(38.61,88.27) 37.21,89.66 C19.2 ; U1.99 44.68,55.02 45.47,54.23 v1(45.47,51.31) ; R4.1 57.14,32.26 v1(55.88,32.26) ; R3.2 v1(54.61,32.26)
  Top Layer w0.508: v1(53.09,73.03) 53.09,71.12 C2.1
  Bottom Layer w0.254: v1(47.5,73.28) 47.24,73.28 v1(46.1,72.14) ; v1(30.1,36.45) v1(35.43,41.78) 41.02,47.37 v1(41.02,49.78) ; v1(38.61,85.98) v1(38.61,88.27) ; v1(54.61,32.26) v1(55.88,32.26) ; v1(41.15,36.07) 41.91,36.07 v1(44.7,38.86) 44.7,40.89 ; v1(87.17,60.07) 84.13,63.12 77.72,63.12 74.3,66.55 v1(73.53,66.55) ; 43.3,50.04 44.57,51.31 v1(45.47,51.31)
  Bottom Layer w0.508: v1(49.4,73.15) 49.78,73.53 52.58,73.53 v1(53.09,73.03) ; 49.4,70.99 45.85,70.99 ; 49.4,70.99 55.63,70.99 ; 49.4,70.99 v1(49.4,70.93) ; U13.5 85.4,48.57 88.65,51.82 88.65,53.72
  vias: v1(33.71,28.45) v1(33.71,24.64) v1(37.81,28.45) v1(37.81,24.64) v1(47.5,74.68) v1(49.4,74.8) v1(74.35,95.12) v1(74.35,91.31) v1(77.14,42.04) v1(77.14,38.23) v1(78.16,14.86) v1(78.16,11.05) v1(78.41,6.99) v1(78.41,3.18) v1(78.45,95.12) v1(78.45,91.31) v1(81.24,42.04) v1(81.24,38.23) v1(82.26,14.86) v1(82.26,11.05) v1(82.52,6.99) v1(82.52,3.18)
BOOT0: length 102.9
  Top Layer w0.254: v1(8,30.35) 8.02,30.35 33.17,55.5 v1(35.18,55.5) 35.18,43.94 43.43,35.69 52.01,35.69 53.93,33.76 53.97,33.76 ; H1.1 6.6,18.8 v1(8,20.19) ; v1(37.34,57.66) 37.85,58.17 45.85,58.17 47.18,56.84 U1.94
  Bottom Layer w0.254: v1(37.34,57.66) v1(35.18,55.5) ; v1(8,30.35) v1(8,20.19)
BOOT1: length 13.2
  Top Layer w0.254: 57.29,33.76 55.5,35.56 v1(53.85,35.56) ; v1(53.59,38.99) 53.09,39.5 49.93,39.5 49.68,39.75 U1.37
  Bottom Layer w0.254: v1(53.85,35.56) 53.59,35.81 v1(53.59,38.99)
ENCODER1_A: length 57
  Top Layer w0.254: v1(47.37,36.32) 43.56,36.32 41.15,38.73 41.15,42.78 41.87,43.5 U1.23 ; v1(49.4,37.72) 66.55,37.72 v1(69.72,40.89)
  Bottom Layer w0.254: v1(69.72,40.89) 71.12,40.89 83.55,28.47 U12.4 ; v1(49.4,37.72) 48.01,36.32 v1(47.37,36.32)
ENCODER1_B: length 54.9
  Top Layer w0.254: U1.24 41.87,43 41.55,42.68 41.55,39.62 44.21,36.96 v1(46.74,36.96) ; v1(69.85,42.04) 66.12,38.3 48.82,38.3 v1(48.77,38.35)
  Bottom Layer w0.254: v1(48.77,38.35) 47.37,36.96 v1(46.74,36.96) ; U12.3 81.81,30.97 70.74,42.04 v1(69.85,42.04)
ENCODER2_A: length 49.8
  Top Layer w0.254: v1(78.99,45.85) 69.47,36.32 48.64,36.32 46.68,38.29 U1.31
  Bottom Layer w0.254: U13.4 79.78,51.07 78.99,50.29 v1(78.99,45.85)
ENCODER2_B: length 50.1
  Top Layer w0.254: v1(77.34,46.23) 68.07,36.96 49.02,36.96 47.18,38.8 U1.32
  Bottom Layer w0.254: v1(77.34,46.23) 77.47,46.36 77.47,51.69 79.36,53.57 U13.3
I2C1_SCL: length 53.5
  Top Layer w0.254: U1.92 48.18,57.23 46.23,59.18 21.84,59.18 v1(9.14,46.48)
  Bottom Layer w0.254: v1(9.14,46.48) 9.14,41.78 U11.2
I2C1_SDA: length 50.6
  Top Layer w0.254: U1.93 47.68,56.98 45.98,58.67 23.62,58.67 15.88,50.93 15.88,47.5 11.43,43.05 7.87,43.05 U11.1
KEY0: length 94.5
  Top Layer w0.254: 14.16,94.49 SW3.2 ; v1(43.43,86.11) 43.31,86.11 42.42,87 v1(32.77,87) ; v1(50.29,79.25) 61.6,67.95 v1(61.6,61.47) ; 14.29,94.36 14.73,94.36 v1(18.16,90.93) ; U1.52 58.65,43 67.69,52.04 v1(67.69,55.37) ; v1(23.24,90.81) 25.53,90.81 v1(28.19,88.14)
  Bottom Layer w0.254: v1(67.69,55.37) v1(61.6,61.47) ; v1(18.16,90.93) 18.29,90.81 v1(23.24,90.81) ; v1(32.77,87) 29.34,87 v1(28.19,88.14) ; v1(50.29,79.25) v1(43.43,86.11)
KEY1: length 91.5
  Top Layer w0.254: v1(49.53,78.74) 60.83,67.44 v1(60.83,60.96) ; SW4.2 13.97,88.9 C30.1 14.03,87.18 v1(15.37,85.85) ; v1(66.93,54.86) 66.93,51.82 58.62,43.5 U1.53
  Bottom Layer w0.254: v1(49.53,78.74) 39.75,78.74 37.85,80.65 20.57,80.65 v1(15.37,85.85) ; v1(66.93,54.86) v1(60.83,60.96)
KEY_UP: length 105.8
  Top Layer w0.254: v1(62.48,62.1) 62.36,62.23 62.36,69.34 v1(51.31,80.39) ; v1(30.73,91.06) 40.51,91.06 v1(44.58,87) ; C28.1 9.53,85.03 9.53,81.57 SW2.2 10.07,82.72 v1(12.7,85.34) ; v1(68.58,55.63) 68.58,52.37 58.72,42.5 U1.51
  Bottom Layer w0.254: v1(30.73,91.06) 29.97,91.06 26.16,87.25 15.11,87.25 13.21,85.34 v1(12.7,85.34) ; v1(44.58,87) 51.31,80.26 v1(51.31,80.39) ; v1(68.58,55.63) 62.48,61.72 v1(62.48,62.1)
LED0: length 75.9
  Top Layer w0.254: v1(58.8,68.33) 60.07,67.06 v1(60.07,60.58) ; U1.57 59.35,45.5 65.66,51.82 v1(65.66,54.1) ; v1(17.53,76.71) 16.33,76.71 16.28,76.75 ; v1(32.64,70.1) 26.03,76.71 v1(19.05,76.71)
  Bottom Layer w0.254: v1(58.8,68.33) 57.02,70.1 v1(32.64,70.1) ; v1(60.07,60.58) 60.07,59.69 v1(65.66,54.1) ; v1(19.05,76.71) v1(17.53,76.71)
LED1: length 73.3
  Top Layer w0.254: v1(59.18,60.33) 59.18,66.68 v1(57.66,68.2) ; v1(32.64,68.2) 25.15,68.2 v1(19.3,74.04) ; v1(17.65,74.04) 16.12,74.04 R14.1 ; U1.58 59.34,46 65.02,51.69 v1(65.02,53.59)
  Bottom Layer w0.254: v1(59.18,60.33) 59.18,59.44 v1(65.02,53.59) ; v1(17.65,74.04) v1(19.3,74.04) ; v1(57.66,68.2) v1(32.64,68.2)
MOTOR1_IN1: length 35.1
  Top Layer w0.254: U1.59 59.33,46.5 64.39,51.56 v1(64.39,51.94) ; v1(67.06,35.31) 67.06,32.26 69.72,29.59 71.13,29.59
  Bottom Layer w0.254: v1(67.06,35.31) 67.06,49.28 v1(64.39,51.94)
MOTOR1_IN2: length 32.8
  Top Layer w0.254: v1(63.63,51.69) 63.63,51.33 59.3,47 U1.60 ; U6.2 70.74,30.86 67.69,33.91 v1(67.69,34.04)
  Bottom Layer w0.254: v1(63.63,51.69) 66.47,48.84 66.47,34.29 66.73,34.04 v1(67.69,34.04)
MOTOR2_IN1: length 15.6
  Top Layer w0.254: v1(59.05,47.62) 58.93,47.5 U1.61 ; v1(62.74,44.96) 66.58,44.96 70.27,48.64 70.62,48.64
  Bottom Layer w0.254: v1(62.74,44.96) 60.07,47.62 v1(59.05,47.62)
MOTOR2_IN2: length 16.9
  Top Layer w0.254: v1(64.26,52.96) 63.5,52.96 58.54,48 U1.62 ; v1(69.34,52.07) 69.34,50.83 70.27,49.91 70.62,49.91
  Bottom Layer w0.254: v1(69.34,52.07) 68.45,52.96 v1(64.26,52.96)
OSC_IN: length 44.4
  Top Layer w0.254: v1(38.1,53.21) 38.1,51.69 40.79,49 U1.12 ; 49.66,64.83 49.39,65.1 49.39,69.7 45.94,73.15 v1(43.05,73.15) ; v1(38.1,72.52) v1(38.1,65.28)
  Bottom Layer w0.254: v1(43.05,73.15) 38.73,73.15 v1(38.1,72.52) ; v1(38.1,53.21) v1(38.1,65.28)
OSC_OUT: length 33.4
  Top Layer w0.254: v1(36.45,57.66) 37.46,56.64 37.46,51.63 40.58,48.51 42.61,48.51 U1.13 ; C27.2 45.97,69.43 45.97,65.25 44.99,64.26 v1(37.21,64.26)
  Bottom Layer w0.254: v1(36.45,57.66) 36.45,63.5 v1(37.21,64.26)
PA13/SWDIO: length 97.2
  Top Layer w0.254: v1(65.28,34.67) 65.28,26.29 61.47,22.48 6.35,22.48 H1.4 ; U1.72 59.52,53 v1(59.69,52.83)
  Bottom Layer w0.254: v1(65.28,34.67) 65.28,47.62 60.07,52.83 v1(59.69,52.83)
PA14/SWCLK: length 65.7
  Top Layer w0.254: U1.76 56.18,54.91 v1(49.91,48.64) ; H1.5 v1(29.97,28.96)
  Bottom Layer w0.254: v1(49.91,48.64) 30.23,28.96 v1(29.97,28.96)
PB3: length 51.3
  Top Layer w0.254: v1(46.48,93.6) 45.72,93.6 H22.4 ; v1(50.8,89.41) 50.8,84.58 45.34,79.12 v1(45.34,77.98) ; v1(50.55,59.44) 49.68,58.57 U1.89 ; v1(51.31,66.55) 51.31,75.06 v1(50.29,76.07)
  Bottom Layer w0.254: v1(50.8,89.41) 50.67,89.41 v1(46.48,93.6) ; v1(51.31,66.55) 51.31,60.2 v1(50.55,59.44) ; v1(45.34,77.98) 45.34,77.34 46.61,76.07 v1(50.29,76.07)
PB4: length 53.2
  Top Layer w0.254: v1(44.58,71.88) 44.58,67.16 43.56,66.15 v1(43.56,65.79) ; H22.3 40.64,96.03 44.35,92.33 v1(44.7,92.33) ; v1(44.45,77.85) 44.45,79.76 49.91,85.22 v1(49.91,89.28) ; v1(49.15,59.44) 49.18,59.41 U1.90
  Bottom Layer w0.254: v1(44.58,71.88) 44.58,77.72 v1(44.45,77.85) ; v1(49.15,59.44) 49.15,61.85 48.4,62.6 43.82,62.6 43.56,62.85 v1(43.56,65.79) ; v1(49.91,89.28) 46.86,92.33 v1(44.7,92.33)
PB5: length 53.5
  Top Layer w0.254: v1(43.82,71.88) 42.42,70.48 v1(42.42,65.79) ; H22.2 41.66,92.58 v1(41.91,92.58) ; v1(47.88,59.44) 48.68,58.64 U1.91 ; v1(49.02,89.03) 49.02,85.85 43.69,80.52 v1(43.69,77.85)
  Bottom Layer w0.254: v1(41.91,92.58) 42.8,91.69 46.36,91.69 v1(49.02,89.03) ; v1(47.88,59.44) 45.34,61.98 43.18,61.98 42.42,62.74 v1(42.42,65.79) ; v1(43.69,77.85) 43.82,77.72 v1(43.82,71.88)
PD7: length 50.6
  Top Layer w0.254: v1(46.1,77.98) 46.1,78.87 51.94,84.71 v1(51.94,89.79) ; v1(47.5,94.23) 45.72,96.01 H22.5 ; U1.88 50.18,57.92 v1(51.56,59.31) ; v1(52.07,66.55) 52.07,75.31 v1(50.42,76.96)
  Bottom Layer w0.254: v1(47.5,94.23) v1(51.94,89.79) ; v1(52.07,66.55) 52.07,59.82 v1(51.56,59.31) ; v1(50.42,76.96) 46.48,76.96 46.1,77.34 v1(46.1,77.98)
PE1: length 53.3
  Top Layer w0.254: v1(47.24,86.74) 41.78,81.28 v1(41.78,66.42) ; U1.98 45.18,56.93 44.58,57.53 v1(42.42,57.53)
  Bottom Layer w0.254: H22.1 35.56,93.73 40.64,88.65 46.48,88.65 47.24,87.88 v1(47.24,86.74) ; v1(42.42,57.53) 41.73,58.22 41.73,66.37 v1(41.78,66.42)
PWM1: length 51.4
  Top Layer w0.254: v1(39.62,56.77) 39.62,54.1 40.72,53 U1.4 ; v1(39.75,65.28) 39.75,80.9 54.23,95.38 H16.2
  Bottom Layer w0.254: v1(39.75,65.28) 39.75,56.9 v1(39.62,56.77)
PWM2: length 60.4
  Top Layer w0.254: v1(38.86,65.28) 38.73,65.41 v1(38.73,70.99) ; U1.5 40.33,52.5 38.73,54.1 v1(38.73,56.77) ; v1(42.42,72.52) 42.42,75.56 43.05,76.2 45.23,76.2 65.05,96.01 H13.2
  Bottom Layer w0.254: v1(38.73,56.77) 38.86,56.9 v1(38.86,65.28) ; v1(38.73,70.99) 39.75,72.01 41.91,72.01 v1(42.42,72.52)
RGB: length 64.5
  Top Layer w0.254: v1(70.1,54.1) 83.44,67.44 v1(87.5,67.44) ; v1(88.52,81.15) 88.57,81.2 CN1.1 ; v1(66.29,53.59) 66.29,51.68 59.61,45 U1.56
  Bottom Layer w0.254: v1(70.1,54.1) 69.93,54.28 66.98,54.28 v1(66.29,53.59) ; v1(87.5,67.44) 88.52,68.45 v1(88.52,81.15)
RST: length 67.8
  Top Layer w0.254: U1.14 40.26,48 36.83,51.44 36.83,55.88 35.81,56.9 24.13,56.9 v1(23.62,57.4) ; v1(23.62,63.5) 18.29,68.83 v1(18.29,77.98) ; v1(12.95,87.76) 12.95,86.11 v1(14.05,85.01)
  Bottom Layer w0.254: v1(14.05,85.01) 18.29,80.77 v1(18.29,77.98) ; v1(23.62,57.4) v1(23.62,63.5) ; v1(12.95,87.76) 13.6,88.4 R11.1 13.65,89.21 C8.1 SW1.1
UART4_RX: length 60.9
  Top Layer w0.254: U1.79 54.61,56.12 v1(54.61,57.4) ; v1(54.48,61.72) 53.98,62.23 17.14,62.23 v1(12.57,66.8) ; v1(6.73,69.6) 6.63,69.6 4.09,72.14 H7.2
  Bottom Layer w0.254: v1(6.73,69.6) 9.53,66.8 v1(12.57,66.8) ; v1(54.61,57.4) 54.61,61.59 v1(54.48,61.72)
UART4_TX: length 62
  Top Layer w0.254: v1(8,70.61) 8,70.72 4.04,74.68 H7.1 ; v1(55.5,59.69) 53.72,61.47 16.89,61.47 v1(10.03,68.33) ; U1.78 55.18,57.08 v1(55.5,57.4)
  Bottom Layer w0.254: v1(8,70.61) 10.03,68.58 v1(10.03,68.33) ; v1(55.5,59.69) v1(55.5,57.4)
UART5_RX: length 48.1
  Top Layer w0.254: U1.83 52.7,56.08 v1(52.7,57.4) ; v1(12.57,55.88) 16.89,60.2 51.69,60.2 v1(52.7,59.18)
  Bottom Layer w0.254: v1(52.7,57.4) v1(52.7,59.18) ; CN7.3 9.94,55.88 v1(12.57,55.88)
UART5_TX: length 52.6
  Top Layer w0.254: v1(53.59,57.4) 54.18,56.82 U1.80 ; v1(18.03,58.67) 13.21,53.85 v1(12.95,53.85) ; v1(17.91,60.83) 18.16,61.09 51.82,61.09 v1(53.47,59.44)
  Bottom Layer w0.254: v1(17.91,60.83) 17.91,58.8 v1(18.03,58.67) ; v1(12.95,53.85) 10.41,53.85 CN7.2 ; v1(53.47,59.44) 53.59,59.31 v1(53.59,57.4)
USART1_RX: length 81.3
  Top Layer w0.254: U1.69 59.98,51.5 62.23,53.75 v1(62.23,54.61)
  Bottom Layer w0.254: v1(62.23,54.61) 58.24,58.6 58.24,66.22 57.28,67.18 15.64,67.18 2.67,54.21 H21.3
USART1_TX: length 81.9
  Top Layer w0.254: U1.68 59.98,51 63.12,54.14 v1(63.12,54.61)
  Bottom Layer w0.254: H21.2 4.19,56.39 15.42,67.61 57.35,67.61 58.6,66.37 58.6,59.13 v1(63.12,54.61)
USART2_RX: length 40.6
  Top Layer w0.254: v1(70.87,69.6) 59.69,58.42 51.84,58.42 50.68,57.26 U1.87
  Bottom Layer w0.254: CN6.3 82.43,71.14 80.89,69.6 v1(70.87,69.6)
USART2_TX: length 41.5
  Top Layer w0.254: U1.86 51.18,56.89 52.32,58.04 60.45,58.04 v1(76.71,74.3)
  Bottom Layer w0.254: v1(76.71,74.3) 83.66,74.3 CN6.2
USART3_RX: length 49.3
  Top Layer w0.254: U1.48 55.18,39.82 55.37,39.62 v1(55.37,39.12) ; v1(55.24,33.27) 55.24,30.73 53.85,29.34 42.04,29.34 28.83,42.55 v1(28.83,44.2) ; v1(30.61,45.97) 31.88,47.24 H17.3
  Bottom Layer w0.254: v1(55.37,39.12) 55.24,38.99 v1(55.24,33.27) ; v1(30.61,45.97) v1(28.83,44.2)
USART3_TX: length 41.4
  Top Layer w0.254: v1(54.61,39.24) 54.61,40.89 U1.47 ; v1(51.94,34.93) 39.88,34.93 29.21,45.59 29.21,46.97 32.03,49.78 H17.2
  Bottom Layer w0.254: v1(54.61,39.24) 54.61,35.31 54.23,34.93 v1(51.94,34.93)
USART6_RX: length 38.1
  Top Layer w0.254: v1(77.22,70.74) 77.22,67.73 58.48,49 U1.64 ; CN8.2 82.4,71.14 v1(81.92,71.63)
  Bottom Layer w0.254: v1(81.92,71.63) 77.72,71.63 77.22,71.12 v1(77.22,70.74)
USART6_TX: length 39.4
  Top Layer w0.254: U1.63 58.49,48.5 78.11,68.12 78.11,72.14 v1(79.63,73.66) ; CN8.3 v1(81.92,73.64)
  Bottom Layer w0.254: v1(81.92,73.64) 81.89,73.66 v1(79.63,73.66)
VEF: length 41.2
  Top Layer w0.254: C25.2 R10.1 33.91,74.4 v1(33.91,62.99) ; 42.57,44.45 41.02,44.45 35.94,49.53 35.94,55.88 35.69,56.13 v1(34.42,56.13) ; U1.21 U1.22
  Bottom Layer w0.254: v1(33.91,62.99) 33.91,56.64 v1(34.42,56.13)
$1N1495: length 32.8
  Top Layer w0.254: v1(40.64,63.63) 51.82,63.63 52.94,64.75 X1.1 52.94,69.07 52.94,69.07 C2.2 ; U1.9 40.94,50.5 v1(40.26,51.18)
  Bottom Layer w0.254: v1(40.64,63.63) 40.26,63.25 v1(40.26,51.18)
$1N1501: length 33.4
  Top Layer w0.254: U1.8 41.45,51 v1(41.15,51.31) ; C1.2 55.5,68.81 55.49,68.8 X1.2 53.65,62.99 v1(41.15,62.99)
  Bottom Layer w0.254: v1(41.15,51.31) 40.77,51.69 40.77,62.61 v1(41.15,62.99)
$1N1585: length 30.7
  Top Layer w0.254: v1(43.43,32) 43.43,33.27 43.94,33.78 C3.2 ; U1.49 55.68,39.83 v1(56.39,39.12)
  Bottom Layer w0.254: v1(43.43,32) 44.32,31.12 v1(58.17,31.12) 59.56,32.51 59.56,35.94 v1(56.39,39.12)
$1N1640: length 46.7
  Top Layer w0.254: v1(52.2,30.23) 52.2,33.02 51.5,33.72 C4.1 ; v1(60.71,53.47) 57.76,53.47 U1.73
  Bottom Layer w0.254: v1(52.2,30.23) 61.98,30.23 65.91,34.16 65.91,48.26 v1(60.71,53.47)
$1N4014: length 3.1
  Top Layer w0.254: R5.1 14.38,70.56 LED1.2
$1N6637: length 2.1
  Top Layer w0.762: LED2.1 10.63,9.3 R6.2
$1N7193: length 2.8
  Top Layer w0.508: LED3.1 65.52,2.85 R7.2
$1N8589: length 14
  Top Layer w0.381: v1(81.41,32.26) 78.89,32.26 77.49,30.86 U6.7 ; U14.2 89.03,30.24 87.01,32.26 v1(86.99,32.26)
  Bottom Layer w0.381: v1(81.41,32.26) v1(86.99,32.26)
$1N8599: length 9.3
  Top Layer w0.381: v1(80.39,36.07) 76.95,32.63 U6.8
  Bottom Layer w0.381: v1(80.39,36.07) 84.21,36.07 U12.1
$1N8605: length 12.4
  Top Layer w0.381: 76.95,29.59 77.98,29.59 v1(78.36,29.21) ; v1(78.36,24.89) v1(78.36,26.67)
  Bottom Layer w0.381: U12.6 79.78,23.47 v1(78.36,24.89) ; v1(78.36,26.67) v1(78.36,29.21)
$1N8980: length 13.2
  Top Layer w0.381: 76.44,49.91 86.6,49.91 U15.2
$1N8984: length 13.9
  Top Layer w0.381: v1(81.66,58.57) 78.77,58.57 76.44,56.25 76.44,51.18
  Bottom Layer w0.381: U13.1 v1(81.66,58.57)
$1N8986: length 8.9
  Top Layer w0.254: v1(80.64,48.64) 76.44,48.64
  Bottom Layer w0.254: U13.6 83.21,46.07 v1(80.64,48.64)
$1N14600: length 8.4
  Top Layer w0.254: SW2.1 2.37,83.03 R12.2 C28.2
$1N15937: length 3.4
  Top Layer w0.254: R15.2 14.74,76.72 LED4.1
$1N16000: length 3.1
  Top Layer w0.254: LED5.1 R14.2
$1N24251: length 31.6
  Top Layer w1.016: v1(28.07,19.05) 30.88,16.24 U5.2 ; v1(17.14,19.05) 10.82,19.05 U4.3
  Bottom Layer w1.016: v1(28.07,19.05) v1(17.14,19.05)

## Copper pours and planes (outline as drawn; the poured copper is in the pictures)
GND on Top Layer: 0,98.68 95.25,98.68 95.25,0 -0.13,0 0,0.13
GND on Bottom Layer: 0,98.68 95.25,98.68 95.25,-0.16 -0.13,0

Small or netless copper shapes (teardrops, artwork), in the pictures only: 344 on Top Layer, 196 on Bottom Layer

## Text on the board
Top Silkscreen Layer: 中国计量大学 / 2000110310 / 陈海威
